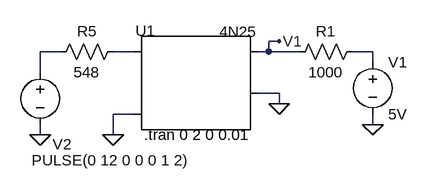
[diagram p0: schematic Digital inputs.asc]
Digital inputs.asc, the LTspice schematic file:
Version 4.1
SHEET 1 880 856
WIRE 320 64 304 64
WIRE -16 80 -48 80
WIRE 96 80 64 80
WIRE 304 80 304 64
WIRE 304 80 288 80
WIRE 352 80 304 80
WIRE 464 80 432 80
WIRE 464 96 464 80
WIRE -48 112 -48 80
WIRE 320 144 288 144
WIRE 320 160 320 144
WIRE 96 176 64 176
WIRE 464 192 464 176
WIRE -48 208 -48 192
WIRE 64 208 64 176
FLAG 320 160 0
FLAG 464 192 0
FLAG 64 208 0
FLAG 320 64 V1
FLAG -48 208 0
SYMBOL Optos\\4N25 192 144 R0
WINDOW 0 -78 -96 Center 2
WINDOW 3 65 -95 Center 2
SYMATTR InstName U1
SYMBOL res 448 64 R90
WINDOW 0 0 56 VBottom 2
WINDOW 3 32 56 VTop 2
SYMATTR InstName R1
SYMATTR Value 1000
SYMBOL voltage 464 80 R0
WINDOW 123 0 0 Left 0
WINDOW 39 0 0 Left 0
SYMATTR InstName V1
SYMATTR Value 5V
SYMBOL res 80 64 R90
WINDOW 0 0 56 VBottom 2
WINDOW 3 32 56 VTop 2
SYMATTR InstName R5
SYMATTR Value 548
SYMBOL voltage -48 96 R0
WINDOW 123 0 0 Left 0
WINDOW 39 0 0 Left 0
WINDOW 0 19 126 Left 2
WINDOW 3 -13 151 Left 2
SYMATTR InstName V2
SYMATTR Value PULSE(0 12 0 0 0 1 2)
TEXT 112 208 Left 2 !.tran 0 2 0 0.01

The netlist it stands for:
* Digital inputs.asc
X§U1 N002 0 V1 0 NC_01 4N25
R1 N003 V1 1000
V1 N003 0 5V
R5 N002 N001 548
V2 N001 0 PULSE(0 12 0 0 0 1 2)
.tran 0 2 0 0.01
.lib 4N25.sub
.backanno
.end